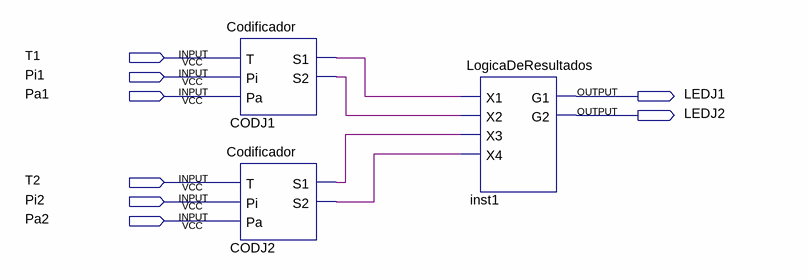
[diagram p0: schematic sheet]
// Quartus schematic Sesion2.bdf as structural Verilog: 3 symbols, 8 pins
module Sesion2 (
  input  T1,
  input  Pi1,
  input  Pa1,
  input  T2,
  input  Pi2,
  input  Pa2,
  output LEDJ1,
  output LEDJ2
);

  wire CODJ1_s1, CODJ1_s2, CODJ2_s1, CODJ2_s2;

  Codificador CODJ1 (.T(T1), .Pi(Pi1), .Pa(Pa1), .S1(CODJ1_s1), .S2(CODJ1_s2));
  Codificador CODJ2 (.T(T2), .Pi(Pi2), .Pa(Pa2), .S1(CODJ2_s1), .S2(CODJ2_s2));
  LogicaDeResultados inst1 (.X1(CODJ1_s1), .X2(CODJ1_s2), .X3(CODJ2_s1), .X4(CODJ2_s2), .G1(LEDJ1), .G2(LEDJ2));
endmodule
